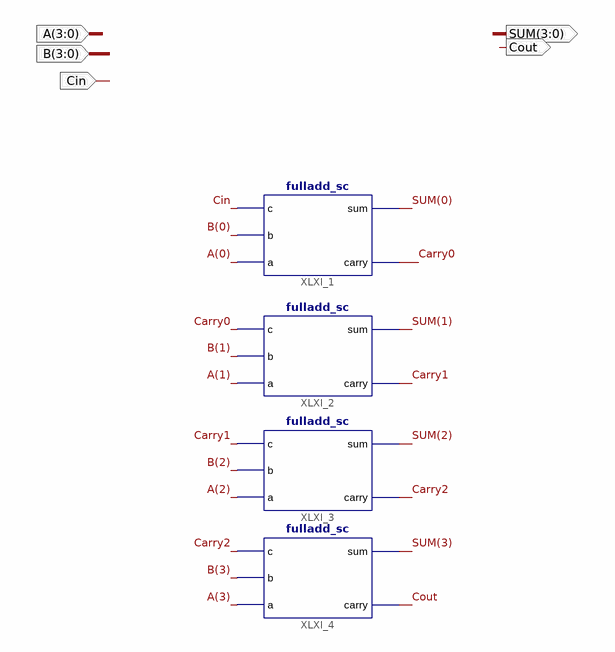
[diagram p0: schematic sheet 1]
// Xilinx ISE schematic fa_4bit_sc.sch (spartan6) as structural Verilog: 4 symbols, 5 ports
module fa_4bit_sc (
  input  [3:0] A,
  input  [3:0] B,
  input  Cin,
  output [3:0] SUM,
  output Cout
);

  wire Carry0, Carry1, Carry2;

  fulladd_sc XLXI_1 (.c(Cin), .b(B[0]), .a(A[0]), .sum(SUM[0]), .carry(Carry0));
  fulladd_sc XLXI_2 (.c(Carry0), .b(B[1]), .a(A[1]), .sum(SUM[1]), .carry(Carry1));
  fulladd_sc XLXI_3 (.c(Carry1), .b(B[2]), .a(A[2]), .sum(SUM[2]), .carry(Carry2));
  fulladd_sc XLXI_4 (.c(Carry2), .b(B[3]), .a(A[3]), .sum(SUM[3]), .carry(Cout));
endmodule
